# EAGLE schematic homedunio (EAGLE 6.4)
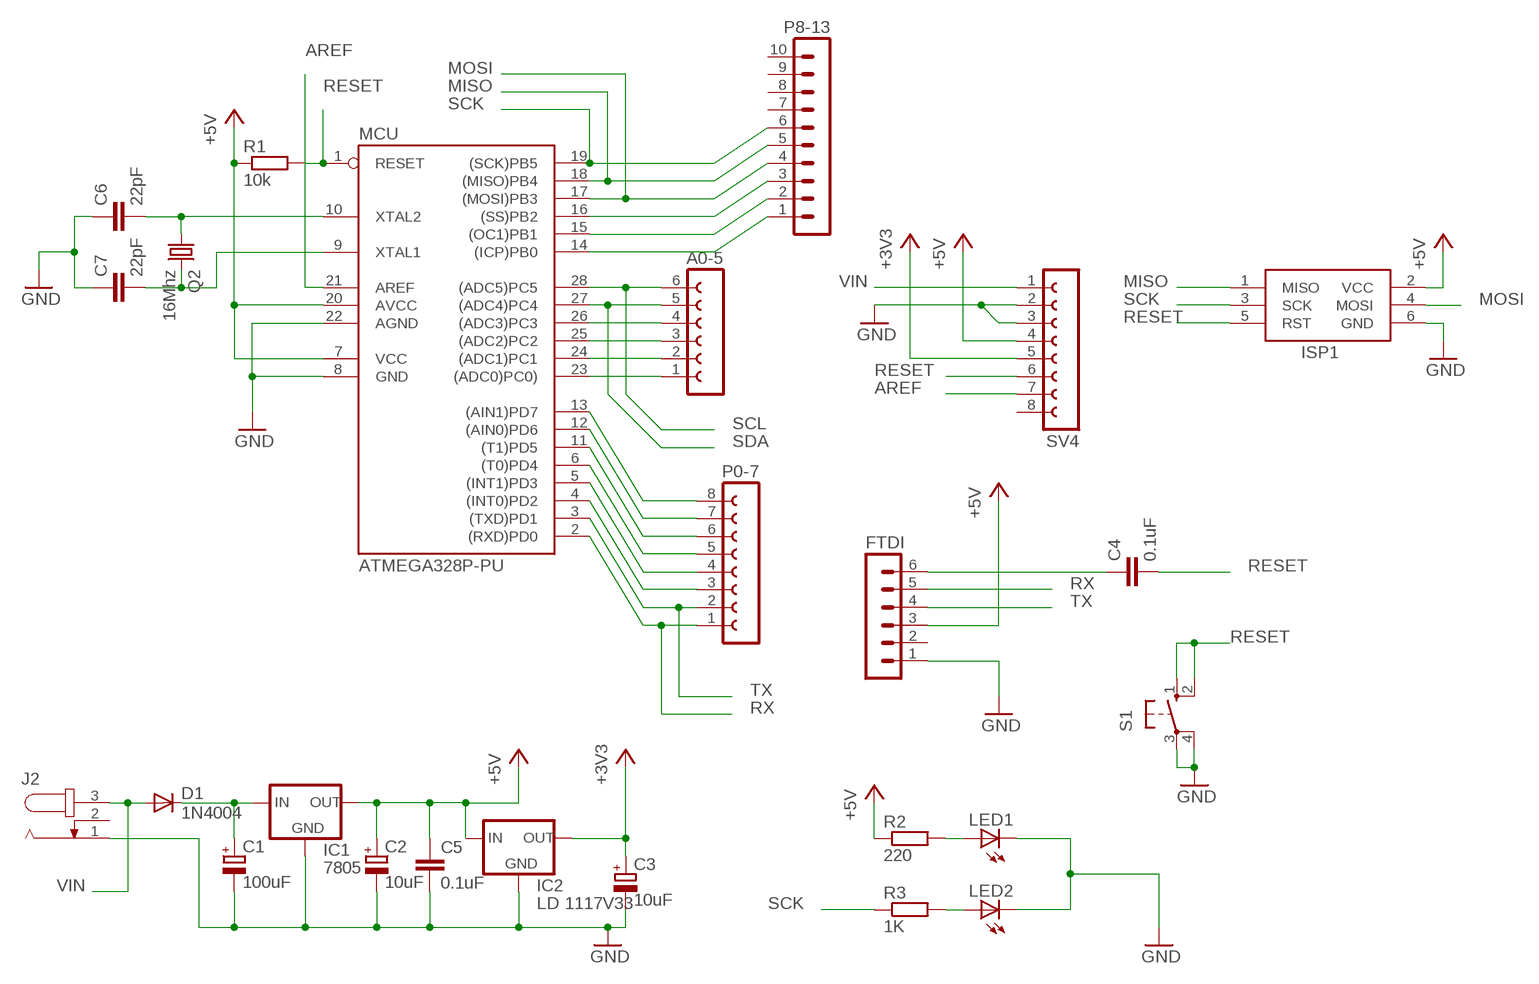
[diagram p0: schematic, sheet 1]

## Parts
A0-5  FE06-1  [FE06]
C1  100uF  CPOL-EUE2.5-5  [E2,5-5]
C2  10uF  CPOL-EUE2.5-5  [E2,5-5]
C3  10uF  CPOL-EUE2.5-5  [E2,5-5]
C4  0.1uF  C-EU025-060X050  [C025-060X050]
C5  0.1uF  C-EU025-060X050  [C025-060X050]
C6  22pF  C-EU025-060X050  [C025-060X050]
C7  22pF  C-EU025-060X050  [C025-060X050]
D1  1N4004  [DO41-10]
FTDI  MA06-1  [MA06-1]
IC1  7805  78XXL  [78XXL]
IC2  LD 1117V33  78XXL  [78XXL]
ISP1  AVRISP-6  [AVRISP]
J2  JACK-PLUG0  [SPC4077]
LED1  LED3MM  [LED3MM]
LED2  LED3MM  [LED3MM]
MCU  ATMEGA328P-PU  [DIL28-3]
P0-7  FE08-1  [FE08]
P8-13  MA10-1  [MA10-1]
Q2  16Mhz  CRYSTALHC49S  [HC49/S]
R1  10k  R-EU_0204/7  [0204/7]
R2  220  R-EU_0204/7  [0204/7]
R3  1K  R-EU_0204/7  [0204/7]
S1  10-XX  [B3F-10XX]
SV4  FE08-1  [FE08]

## Nets
+3V3: C3.+ IC2.OUT SV4.5
+5V: C2.+ C5.1 FTDI.3 IC1.OUT IC2.IN ISP1.2(VCC) MCU.7(VCC) MCU.20(AVCC) R1.1 R2.1 SV4.4
AREF: MCU.21(AREF) SV4.7
GND: C1.- C2.- C3.- C5.2 C6.1 C7.1 FTDI.1 IC1.GND IC2.GND ISP1.6(GND) J2.1 LED1.K(C) LED2.K(C) MCU.8(GND) MCU.22(AGND) S1.3(P) S1.4(P1) SV4.2 SV4.3
MISO: ISP1.1(MISO) MCU.18((MISO)PB4) P8-13.5
MOSI: ISP1.4(MOSI) MCU.17((MOSI)PB3) P8-13.4
N$1: C4.1 FTDI.6
N$2: C1.+ D1.C IC1.IN
N$4: A0-5.1 MCU.23((ADC0)PC0))
N$5: A0-5.2 MCU.24((ADC1)PC1)
N$6: A0-5.3 MCU.25((ADC2)PC2)
N$7: A0-5.4 MCU.26((ADC3)PC3)
N$12: MCU.4((INT0)PD2) P0-7.3
N$13: MCU.5((INT1)PD3) P0-7.4
N$14: MCU.6((T0)PD4) P0-7.5
N$15: MCU.11((T1)PD5) P0-7.6
N$16: MCU.12((AIN0)PD6) P0-7.7
N$17: MCU.13((AIN1)PD7) P0-7.8
N$20: MCU.14((ICP)PB0) P8-13.1
N$21: MCU.15((OC1)PB1) P8-13.2
N$22: MCU.16((SS)PB2) P8-13.3
N$28: LED1.A R2.2
N$29: LED2.A R3.2
N$37: C6.2 MCU.10(XTAL2) Q2.1
N$38: C7.2 MCU.9(XTAL1) Q2.2
RESET: C4.2 ISP1.5(RST) MCU.1(RESET) R1.2 S1.1(S) S1.2(S1) SV4.6
RX: FTDI.5 MCU.2((RXD)PD0) P0-7.1
SCK: ISP1.3(SCK) MCU.19((SCK)PB5) P8-13.6 R3.1
SCL: A0-5.6 MCU.28((ADC5)PC5)
SDA: A0-5.5 MCU.27((ADC4)PC4)
TX: FTDI.4 MCU.3((TXD)PD1) P0-7.2
VIN: D1.A J2.3 SV4.1
Unconnected: FTDI.2 J2.2 P8-13.7 P8-13.8 P8-13.9 P8-13.10 SV4.8

## Library data of the parts
A0-5 = con-lsta:FE06-1: FEMALE HEADER; OC_FARNELL: unknown; OC_NEWARK: unknown
C1-C3 = rcl:CPOL-EU: POLARIZED CAPACITOR, European symbol
C4-C7 = rcl:C-EU: CAPACITOR, European symbol
D1 = diode:1N4004: DIODE general purpose rectifier, 1 A
FTDI = con-lstb:MA06-1: PIN HEADER; OC_FARNELL: unknown; OC_NEWARK: unknown
IC1 IC2 = v-reg:78XXL: VOLTAGE REGULATOR
ISP1 = adafruit:AVRISP: AVR ISP HEADER Standard 6 pin header for AVR programming
J2 = con-jack:JACK-PLUG: DC POWER JACK Power Jack, DC, Right Angle, Through Hole, Rated 5A at 16VDC, PC Terminals Distributor: Farnell (www.Farnell.de) Drawing: 84N1161.pdf / 84N1162.pdf Manufacturer: SPC Technology (www.spctechnology.com) Type: SPC4077 / SPC 4078; OC_FARNELL: unknown; OC_NEWARK: unknown
LED1 LED2 = led:LED: LED OSRAM: - CHIPLED LG R971, LG N971, LY N971, LG Q971, LY Q971, LO R971, LY R971 LH N974, LH R974 LS Q976, LO Q976, LY Q976 LO Q996 - Hyper CHIPLED LW Q18S LB Q993, LB Q99A, LB R99A - SideLED LS A670, LO A670, LY A670, LG A670, LP A670 LB A673, LV A673, LT A673, LW A673 LH A674 LY A675 LS A676, LA A676, LO A676, LY A676, LW A676 LS A679, LY A679, LG A679 - Hyper Micro SIDELED® LS Y876, LA Y876, LO Y876, LY Y876 LT Y87S - SmartLED LW L88C, LW L88S LB L89C, LB L89S, LG L890 LS L89K, LO L89K, LY L89K LS L896, LA L896, LO L896, LY L896 - TOPLED LS T670, LO T670, LY T670, LG T670, LP T670 LSG T670, LSP T670, LSY T670, LOP T670, LYG T670 LG T671, LOG T671, LSG T671 LB T673, LV T673, LT T673, LW T673 LH T674 LS T676, LA T676, LO T676, LY T676, LB T676, LH T676, LSB T676, LW T676 LB T67C, LV T67C, LT T67C, LS T67K, LO T67K, LY T67K, LW E67C LS E67B, LA E67B, LO E67B, LY E67B, LB E67C, LV E67C, LT E67C LW T67C LS T679, LY T679, LG T679 LS T770, LO T770, LY T770, LG T770, LP T770 LB T773, LV T773, LT T773, LW T773 LH T774 LS E675, LA E675, LY E675, LS T675 LS T776, LA T776, LO T776, LY T776, LB T776 LHGB T686 LT T68C, LB T68C - Hyper Mini TOPLED® LB M676 - Mini TOPLED Santana® LG M470 LS M47K, LO M47K, LY M47K Source: http://www.osram.convergy.de LUXEON: - LUMILED® LXK2-PW12-R00, LXK2-PW12-S00, LXK2-PW14-U00, LXK2-PW14-V00 LXK2-PM12-R00, LXK2-PM12-S00, LXK2-PM14-U00 LXK2-PE12-Q00, LXK2-PE12-R00, LXK2-PE12-S00, LXK2-PE14-T00, LXK2-PE14-U00 LXK2-PB12-K00, LXK2-PB12-L00, LXK2-PB12-M00, LXK2-PB14-N00, LXK2-PB14-P00, LXK2-PB14-Q00 LXK2-PR12-L00, LXK2-PR12-M00, LXK2-PR14-Q00, LXK2-PR14-R00 LXK2-PD12-Q00, LXK2-PD12-R00, LXK2-PD12-S00 LXK2-PH12-R00, LXK2-PH12-S00 LXK2-PL12-P00, LXK2-PL12-Q00, LXK2-PL12-R00 Source: www.luxeon.com KINGBRIGHT: KA-3528ASYC Source: www.kingbright.com
MCU = SmartPrj:ATMEGA328P-: MICROCONTROLLER 4 Kbytes FLASH 128 bytes SRAM 256 bytes EEPROM UART 6-channel 10 bit ADC
P0-7 SV4 = con-lsta:FE08-1: FEMALE HEADER; OC_FARNELL: unknown; OC_NEWARK: unknown
P8-13 = con-lstb:MA10-1: PIN HEADER; OC_FARNELL: unknown; OC_NEWARK: unknown
Q2 = crystal:CRYSTAL: CRYSTAL; OC_FARNELL: 1667008; OC_NEWARK: unknown
R1-R3 = rcl:R-EU_: RESISTOR, European symbol
S1 = switch-omron:10-XX: OMRON SWITCH; MPN: B3F-1000; OC_FARNELL: 176432; OC_NEWARK: 36M3542

## Net classes
2 gnd: width 0.254 mm, drill 0.61 mm, clearance 0.254 mm